# Altium project LimePSB-RPCM_1v3.PrjPcb (part 10 of 14)

## Sheet 13_RFFE.SchDoc: RF front end
size A3; Organization: Lime Microsystems; Address1: Surrey Tech Centre; Address2: Guildford GU2 7YG; Address3: Surrey; Address4: United Kingdom; Revision: v1.3; SheetNumber: 11; SheetTotal: 13
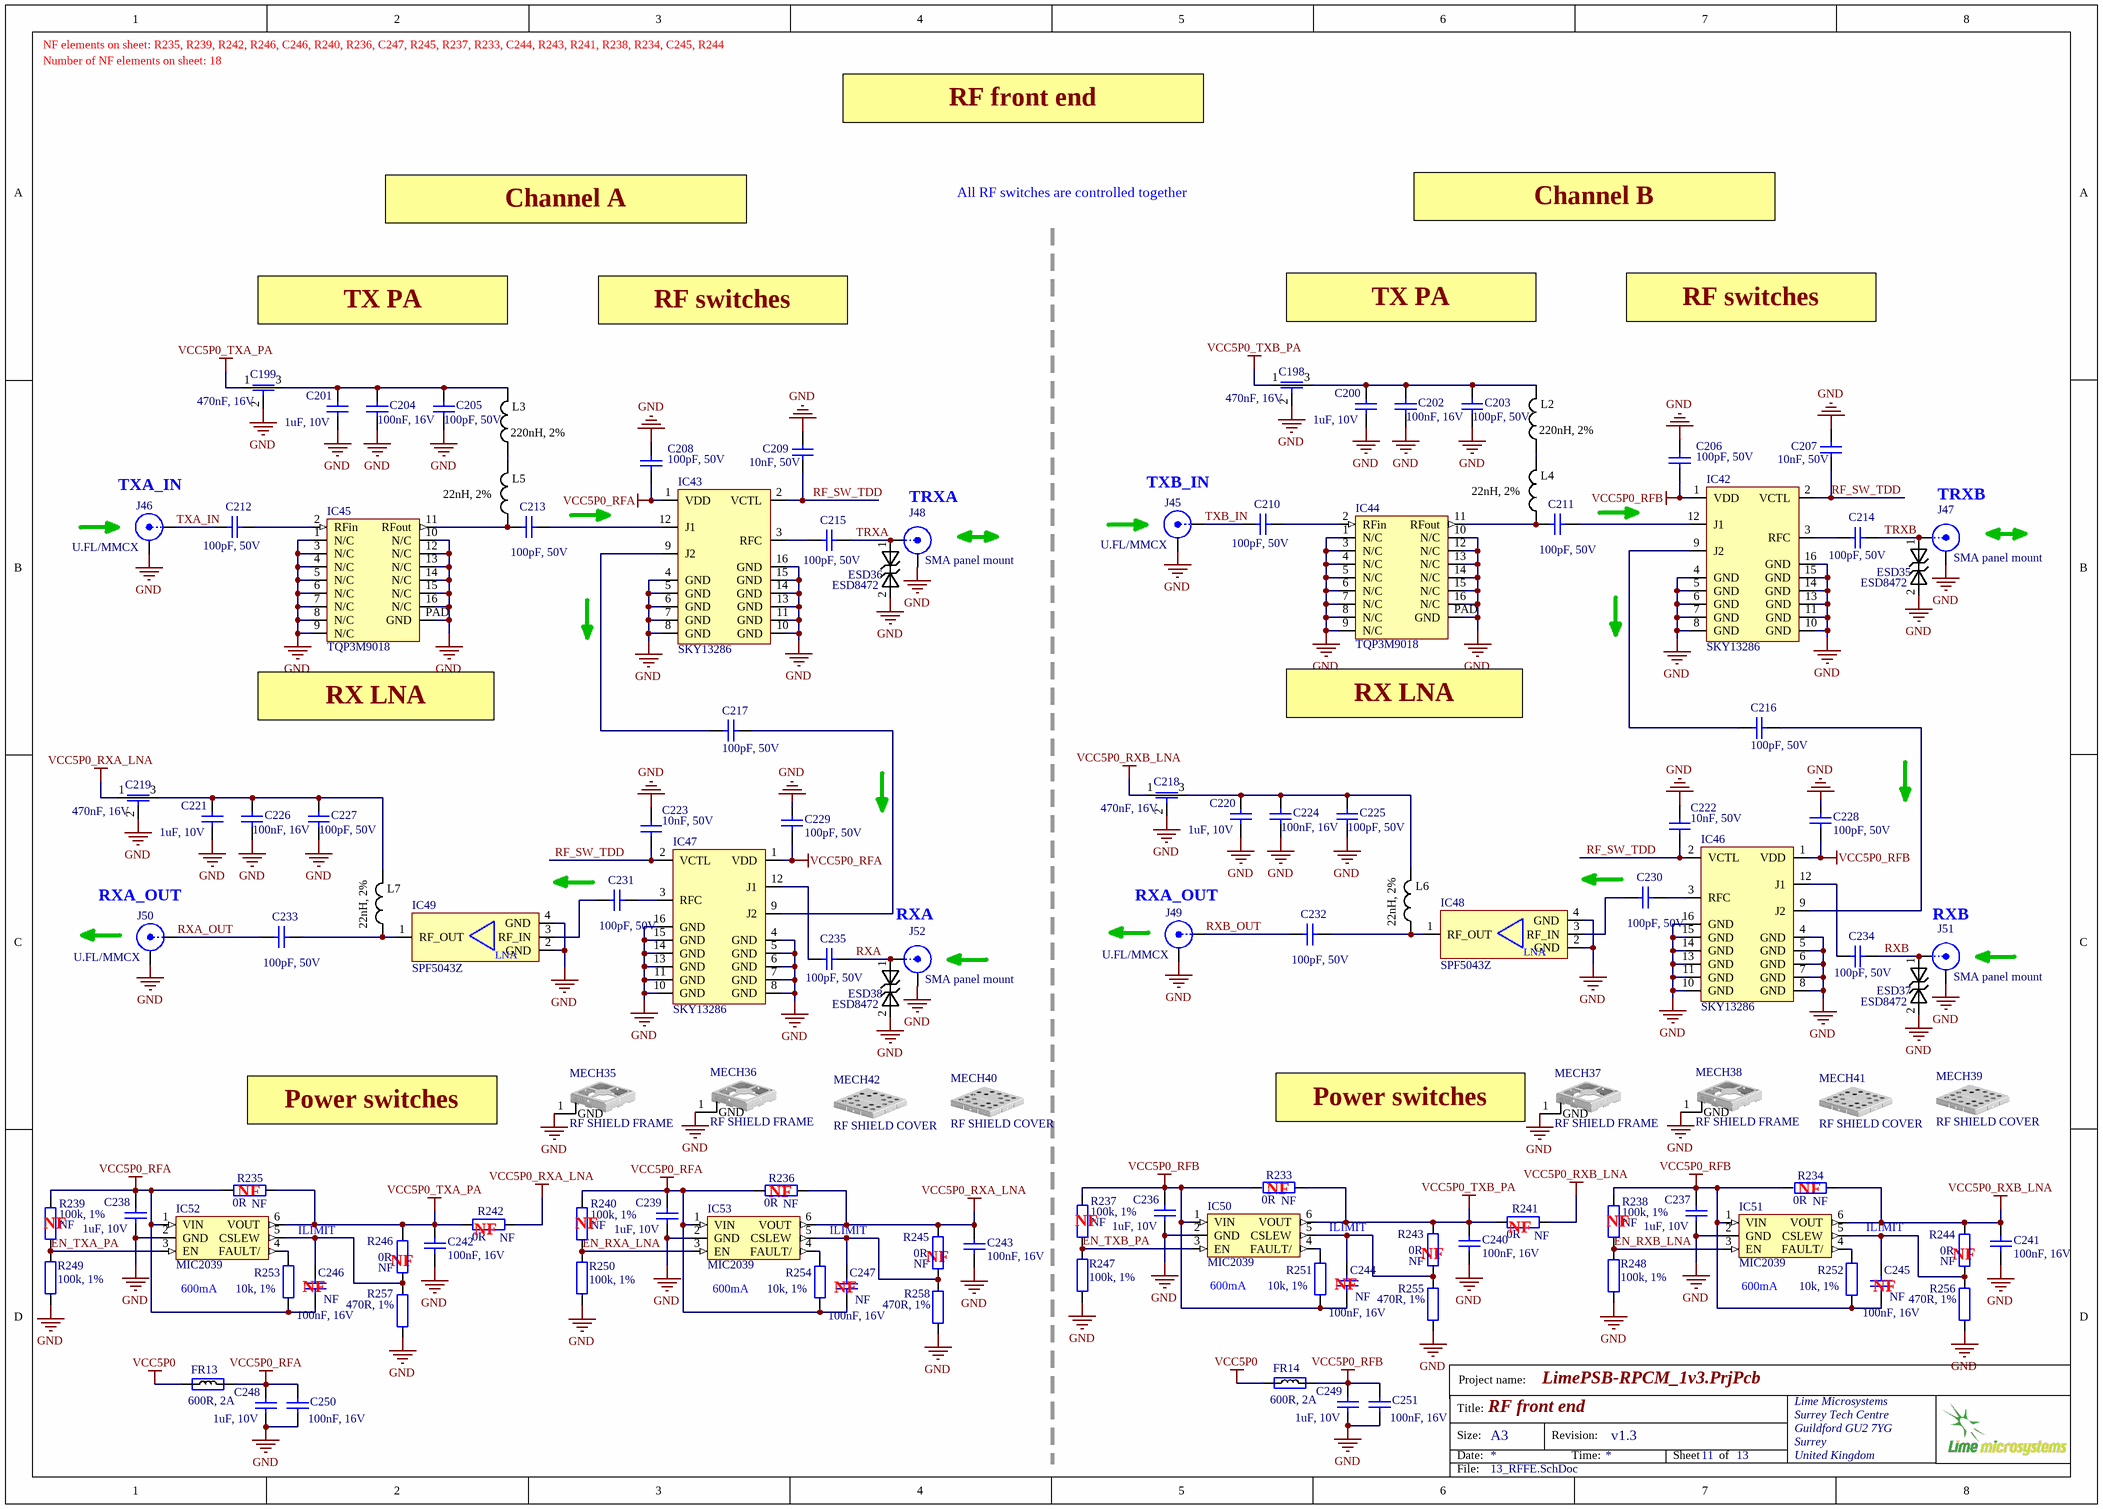
[diagram p12: 13_RFFE.SchDoc]

### Parts
C198  470nF, 16V  [CAP0805_FEEDTHROUGH]
C199  470nF, 16V  [CAP0805_FEEDTHROUGH]
C200  1uF, 10V  [CAP0402]
C201  1uF, 10V  [CAP0402]
C202  100nF, 16V  [CAP0402]
C203  100pF, 50V  [CAP0402]
C204  100nF, 16V  [CAP0402]
C205  100pF, 50V  [CAP0402]
C206  100pF, 50V  [CAP0402]
C207  10nF, 50V  [CAP0402]
C208  100pF, 50V  [CAP0402]
C209  10nF, 50V  [CAP0402]
C210  100pF, 50V  [CAP0402]
C211  100pF, 50V  [CAP0402]
C212  100pF, 50V  [CAP0402]
C213  100pF, 50V  [CAP0402]
C214  100pF, 50V  [CAP0402]
C215  100pF, 50V  [CAP0402]
C216  100pF, 50V  [CAP0402]
C217  100pF, 50V  [CAP0402]
C218  470nF, 16V  [CAP0805_FEEDTHROUGH]
C219  470nF, 16V  [CAP0805_FEEDTHROUGH]
C220  1uF, 10V  [CAP0402]
C221  1uF, 10V  [CAP0402]
C222  10nF, 50V  [CAP0402]
C223  10nF, 50V  [CAP0402]
C224  100nF, 16V  [CAP0402]
C225  100pF, 50V  [CAP0402]
C226  100nF, 16V  [CAP0402]
C227  100pF, 50V  [CAP0402]
C228  100pF, 50V  [CAP0402]
C229  100pF, 50V  [CAP0402]
C230  100pF, 50V  [CAP0402]
C231  100pF, 50V  [CAP0402]
C232  100pF, 50V  [CAP0402]
C233  100pF, 50V  [CAP0402]
C234  100pF, 50V  [CAP0402]
C235  100pF, 50V  [CAP0402]
C236  1uF, 10V  [CAP0402]
C237  1uF, 10V  [CAP0402]
C238  1uF, 10V  [CAP0402]
C239  1uF, 10V  [CAP0402]
C240  100nF, 16V  [CAP0402]
C241  100nF, 16V  [CAP0402]
C242  100nF, 16V  [CAP0402]
C243  100nF, 16V  [CAP0402]
C244  100nF, 16V  Assembly Info: NF  [CAP0402]
C245  100nF, 16V  Assembly Info: NF  [CAP0402]
C246  100nF, 16V  Assembly Info: NF  [CAP0402]
C247  100nF, 16V  Assembly Info: NF  [CAP0402]
C248  1uF, 10V  [CAP0402]
C249  1uF, 10V  [CAP0402]
C250  100nF, 16V  [CAP0402]
C251  100nF, 16V  [CAP0402]
ESD35  ESD8472  [ESD8472_X3DFN2]
ESD36  ESD8472  [ESD8472_X3DFN2]
ESD37  ESD8472  [ESD8472_X3DFN2]
ESD38  ESD8472  [ESD8472_X3DFN2]
FR13  600R, 2A  [RES0805]
FR14  600R, 2A  [RES0805]
IC42  SKY13286  [SKY13286-359LF_RF_switch_QFN16]
IC43  SKY13286  [SKY13286-359LF_RF_switch_QFN16]
IC44  TQP3M9018  [TQP3M9018_PA_QFN16]
IC45  TQP3M9018  [TQP3M9018_PA_QFN16]
IC46  SKY13286  [SKY13286-359LF_RF_switch_QFN16]
IC47  SKY13286  [SKY13286-359LF_RF_switch_QFN16]
IC48  SPF5043Z  [SPF5043Z_SOT-343]
IC49  SPF5043Z  [SPF5043Z_SOT-343]
IC50  MIC2039  [SOT23-6]
IC51  MIC2039  [SOT23-6]
IC52  MIC2039  [SOT23-6]
IC53  MIC2039  [SOT23-6]
J45  U.FL/MMCX  [MMCX_UFL_conn_u]
J46  U.FL/MMCX  [MMCX_UFL_conn_u]
J47  SMA panel mount  [SMA_connector_side]
J48  SMA panel mount  [SMA_connector_side]
J49  U.FL/MMCX  [MMCX_UFL_conn_u]
J50  U.FL/MMCX  [MMCX_UFL_conn_u]
J51  SMA panel mount  [SMA_connector_side]
J52  SMA panel mount  [SMA_connector_side]
L2  220nH, 2%  [RES0603]
L3  220nH, 2%  [RES0603]
L4  22nH, 2%  [RES0603]
L5  22nH, 2%  [RES0603]
L6  22nH, 2%  [RES0603]
L7  22nH, 2%  [RES0603]
MECH35  RF SHIELD FRAME  [RF_SHIELD_FRAME_16P5x16P5_2118716-2_v1]
MECH36  RF SHIELD FRAME  [RF_SHIELD_FRAME_16P5x16P5_2118716-2_v1]
MECH37  RF SHIELD FRAME  [RF_SHIELD_FRAME_16P5x16P5_2118716-2_v1]
MECH38  RF SHIELD FRAME  [RF_SHIELD_FRAME_16P5x16P5_2118716-2_v1]
MECH39  RF SHIELD COVER  [RF_SHIELD_COVER_16Px916P9_2118715-2]
MECH40  RF SHIELD COVER  [RF_SHIELD_COVER_16Px916P9_2118715-2]
MECH41  RF SHIELD COVER  [RF_SHIELD_COVER_16Px916P9_2118715-2]
MECH42  RF SHIELD COVER  [RF_SHIELD_COVER_16Px916P9_2118715-2]
R233  0R  Assembly Info: NF  [RES0402]
R234  0R  Assembly Info: NF  [RES0402]
R235  0R  Assembly Info: NF  [RES0402]
R236  0R  Assembly Info: NF  [RES0402]
R237  100k, 1%  Assembly Info: NF  [RES0402]
R238  100k, 1%  Assembly Info: NF  [RES0402]
R239  100k, 1%  Assembly Info: NF  [RES0402]
R240  100k, 1%  Assembly Info: NF  [RES0402]
R241  0R  Assembly Info: NF  [RES0805]
R242  0R  Assembly Info: NF  [RES0805]
R243  0R  Assembly Info: NF  [RES0402]
R244  0R  Assembly Info: NF  [RES0402]
R245  0R  Assembly Info: NF  [RES0402]
R246  0R  Assembly Info: NF  [RES0402]
R247  100k, 1%  [RES0402]
R248  100k, 1%  [RES0402]
R249  100k, 1%  [RES0402]
R250  100k, 1%  [RES0402]
R251  10k, 1%  [RES0402]
R252  10k, 1%  [RES0402]
R253  10k, 1%  [RES0402]
R254  10k, 1%  [RES0402]
R255  470R, 1%  [RES0402]
R256  470R, 1%  [RES0402]
R257  470R, 1%  [RES0402]
R258  470R, 1%  [RES0402]

### Nets
GND: C198.2 C199.2 C200.1 C201.1 C202.2 C203.1 C204.2 C205.1 C206.2 C207.1 C208.2 C209.1 C218.2 C219.2 C220.1 C221.1 C222.2 C223.2 C224.2 C225.1 C226.2 C227.1 C228.2 C229.2 C236.2 C237.2 C238.2 C239.2 C240.2 C241.2 C242.2 C243.2 C248.1 C249.1 C250.2 C251.2 ESD35.2 ESD36.2 ESD37.2 ESD38.2 IC42.4(GND) IC42.5(GND) IC42.6(GND) IC42.7(GND) IC42.8(GND) IC42.10(GND) IC42.11(GND) IC42.13(GND) IC42.14(GND) IC42.15(GND) IC42.16(GND) IC43.4(GND) IC43.5(GND) IC43.6(GND) IC43.7(GND) IC43.8(GND) IC43.10(GND) IC43.11(GND) IC43.13(GND) IC43.14(GND) IC43.15(GND) IC43.16(GND) IC44.1(N/C) IC44.3(N/C) IC44.4(N/C) IC44.5(N/C) IC44.6(N/C) IC44.7(N/C) IC44.8(N/C) IC44.9(N/C) IC44.10(N/C) IC44.12(N/C) IC44.13(N/C) IC44.14(N/C) IC44.15(N/C) IC44.16(N/C) IC44.PAD(GND) IC45.1(N/C) IC45.3(N/C) IC45.4(N/C) IC45.5(N/C) IC45.6(N/C) IC45.7(N/C) IC45.8(N/C) IC45.9(N/C) IC45.10(N/C) IC45.12(N/C) IC45.13(N/C) IC45.14(N/C) IC45.15(N/C) IC45.16(N/C) IC45.PAD(GND) IC46.4(GND) IC46.5(GND) IC46.6(GND) IC46.7(GND) IC46.8(GND) IC46.10(GND) IC46.11(GND) IC46.13(GND) IC46.14(GND) IC46.15(GND) IC46.16(GND) IC47.4(GND) IC47.5(GND) IC47.6(GND) IC47.7(GND) IC47.8(GND) IC47.10(GND) IC47.11(GND) IC47.13(GND) IC47.14(GND) IC47.15(GND) IC47.16(GND) IC48.2(GND) IC48.4(GND) IC49.2(GND) IC49.4(GND) IC50.2(GND) IC51.2(GND) IC52.2(GND) IC53.2(GND) J45.2(Y) J46.2(Y) J47.2(Y) J48.2(Y) J49.2(Y) J50.2(Y) J51.2(Y) J52.2(Y) MECH35.1(GND) MECH36.1(GND) MECH37.1(GND) MECH38.1(GND) R247.2 R248.2 R249.2 R250.2 R255.1 R256.1 R257.1 R258.1
VCC5P0: FR13.1 FR14.1
VCC5P0_RFA: C208.1 C229.1 C238.1 C239.1 C246.2 C247.2 C248.2 C250.1 FR13.2 IC43.1(VDD) IC47.1(VDD) IC52.1(VIN) IC53.1(VIN) R235.2 R236.2 R239.1 R240.1 R253.1 R254.1
VCC5P0_RFB: C206.1 C228.1 C236.1 C237.1 C244.2 C245.2 C249.2 C251.1 FR14.2 IC42.1(VDD) IC46.1(VDD) IC50.1(VIN) IC51.1(VIN) R233.2 R234.2 R237.1 R238.1 R251.1 R252.1
VCC5P0_RXA_LNA: C219.1 C243.1 IC53.6(VOUT) R236.1 R242.1 R245.2
VCC5P0_RXB_LNA: C218.1 C241.1 IC51.6(VOUT) R234.1 R241.1 R244.2
VCC5P0_TXA_PA: C199.1 C242.1 IC52.6(VOUT) R235.1 R242.2 R246.2
VCC5P0_TXB_PA: C198.1 C240.1 IC50.6(VOUT) R233.1 R241.2 R243.2
EN_RXA_LNA: IC53.3(EN) R240.2 R250.1
EN_RXB_LNA: IC51.3(EN) R238.2 R248.1
EN_TXA_PA: IC52.3(EN) R239.2 R249.1
EN_TXB_PA: IC50.3(EN) R237.2 R247.1
RF_SW_TDD: C207.2 C209.2 C222.1 C223.1 IC42.2(VCTL) IC43.2(VCTL) IC46.2(VCTL) IC47.2(VCTL)
RXA: C235.1 ESD38.1 J52.1(X)
RXA_OUT: C233.2 J50.1(X)
RXB: C234.1 ESD37.1 J51.1(X)
RXB_OUT: C232.2 J49.1(X)
TRXA: C215.1 ESD36.1 J48.1(X)
TRXB: C214.1 ESD35.1 J47.1(X)
TXA_IN: C212.2 J46.1(X)
TXB_IN: C210.2 J45.1(X)
NetC198_3: C198.3 C200.2 C202.1 C203.2 L2.1
NetC199_3: C199.3 C201.2 C204.1 C205.2 L3.1
NetC210_1: C210.1 IC44.2(RFin)
NetC211_1: C211.1 IC42.12(J1)
NetC211_2: C211.2 IC44.11(RFout) L4.2
NetC212_1: C212.1 IC45.2(RFin)
NetC213_1: C213.1 IC43.12(J1)
NetC213_2: C213.2 IC45.11(RFout) L5.2
NetC214_2: C214.2 IC42.3(RFC)
NetC215_2: C215.2 IC43.3(RFC)
NetC216_1: C216.1 IC46.9(J2)
NetC216_2: C216.2 IC42.9(J2)
NetC217_1: C217.1 IC47.9(J2)
NetC217_2: C217.2 IC43.9(J2)
NetC218_3: C218.3 C220.2 C224.1 C225.2 L6.1
NetC219_3: C219.3 C221.2 C226.1 C227.2 L7.1
NetC230_1: C230.1 IC46.3(RFC)
NetC230_2: C230.2 IC48.3(RF_IN)
NetC231_1: C231.1 IC47.3(RFC)
NetC231_2: C231.2 IC49.3(RF_IN)
NetC232_1: C232.1 IC48.1(RF_OUT) L6.2
NetC233_1: C233.1 IC49.1(RF_OUT) L7.2
NetC234_2: C234.2 IC46.12(J1)
NetC235_2: C235.2 IC47.12(J1)
NetC244_1: C244.1 IC50.5(CSLEW) R243.1 R255.2
NetC245_1: C245.1 IC51.5(CSLEW) R244.1 R256.2
NetC246_1: C246.1 IC52.5(CSLEW) R246.1 R257.2
NetC247_1: C247.1 IC53.5(CSLEW) R245.1 R258.2
NetIC50_4: IC50.4(FAULT/) R251.2
NetIC51_4: IC51.4(FAULT/) R252.2
NetIC52_4: IC52.4(FAULT/) R253.2
NetIC53_4: IC53.4(FAULT/) R254.2
NetL2_2: L2.2 L4.1
NetL3_2: L3.2 L5.1

### Notes on the sheet
- NF elements on sheet: R235, R239, R242, R246, C246, R240, R236, C247, R245, R237, R233, C244, R243, R241, R238, R234, C245, R244
- Number of NF elements on sheet: 18
- RF front end
- Channel A
- All RF switches are controlled together
- Channel B
- TX PA
- RF switches
- (near J46) TXA_IN
- TRXA
- (near J45) TXB_IN
- TRXB
- (near IC45) RX LNA
- (near IC44) RX LNA
- (near J50) RXA_OUT
- RXA
- (near J49) RXA_OUT
- RXB
- Power switches
- (near MECH37) Power switches
- (near R233) NF
- (near R234) NF
- (near R239) NF
- (near R235) NF
- ILIMIT
- (near R242) NF
- (near R240) NF
- (near R236) NF
- (near R245) NF
- (near R237) NF
- (near R243) NF
- (near R241) NF
- (near R238) NF
- (near R244) NF
- (near IC52) 600mA
- NF
- (near R246) NF
- (near IC53) 600mA
- (near IC50) 600mA
- (near IC51) 600mA
- (near C245) NF
- Project name:
- Title:
- Size:
- Date:
- A3
- Revision:
- Time:
- Sheet
- of
- File:
- (in symbol SPF5043Z_RF_LNA) LNA

### Library data of the parts
C198 C199 C218 C219 = Cap_feed_through: Part Description: 0.47µF Feed Through Capacitor 16V 2A 30mOhm 0805 (2012 Metric), 3 PC Pad; Manufacturer: Murata; Manufacturer Part Number 1: NFM21PC474R1C3D; Max Current Rating: 2A; Tolerance: 20%; DC Resistance (DCR): 30mR; Insulation Resistance: 1GR; Value: 470nF, 16V; Supplier 1: Digi-Key; Supplier Part Number 1: 490-2537-1-ND; Stock 1: 220606; Pricing 1: 1=0,25000, 10=0,22900, 25=0,21840, 50=0,21160, 100=0,20450, 250=0,19392, 500=0,16218, 1000=0,12586 (USD); Mount: Surface Mount,PCB; Case/Package: 0805; Weight: 0.000194oz; Case Code (Metric): 2012; Case Code (Imperial): 0805; Min Operating Temperature: -55°C; Max Operating Temperature: 125°C; Package Quantity: 1; Capacitance: 470nF; Packaging: Tape and Reel; Max Voltage Rating (DC): 16V; Current Rating: 2A; Voltage Rating: 16V; Voltage Rating (DC): 16V; Voltage: 16V; Current: 2A; Termination: Flat; Length: 2mm; Height: 0.85mm; Width: 1.25mm; Depth: 1.25mm; Radiation Hardening: No; REACH SVHC: No SVHC; Lead Free: Lead Free; RoHS: Yes
C200 C201 C220 C221 C248 C249 = Cap_0402: CAP CER 1UF 10V X5R 0402; Manufacturer: Yageo; Part Description: 1µF 10V Ceramic Capacitor X5R 0402 (1005 Metric) 0.039" L x 0.020" W (1.00mm x 0.50mm); Manufacturer Part Number 1: CC0402MRX5R6BB105; Notification: Current market demand for these product types have resulted in fluctuating and extending lead times. Lead times may differ.; Tolerance: ±20%; Value: 1uF, 10V; Supplier 1: Digi-Key; Supplier Part Number 1: 311-1732-1-ND; RoHS: RoHS Compliant; Applications: General Purpose; Category: Capacitors; ComponentLink1Description: http://www.yageo.com/documents/recent/UPY-GPHC_X5R_4V-to-50V_25.pdf; ComponentLink1URL: http://www.yageo.com/documents/recent/UPY-GPHC_X5R_4V-to-50V_25.pdf; Failure Rate: -; Features: -; Height - Seated (Max): -; Lead Spacing: -; Lead Style: -; Mounting Type: Surface Mount, MLCC; Operating Temperature: -55°C ~ 85°C; Package / Case: 0402 (1005 Metric); Packaging: Cut Tape (CT); Part Status: Active; Pricing 1: 1=0.22, 10=0.156, 100=0.0732, 500=0.0513, 1000=0.04248, 2500=0.03953, 5000=0.03617 (USD); Ratings: -; Size / Dimension: 0.039" L x 0.020" W (1.00mm x 0.50mm); Stock 1: 69600; Temperature Coefficient: X5R; Thickness (Max): 0.022" (0.55mm); Voltage - Rated: 10V
C202 C204 C224 C226 C240-C247 = Cap_0402: Manufacturer: Murata Electronics; Manufacturer Part Number 1: GRM155R71C104KA88D; Part Description: 0.10µF ±10% 16V Ceramic Capacitor X7R 0402 (1005 Metric); Tolerance: 10 %; Type: General Purpose MLCC; Capacitance: 0.1 uF; Case Length: 1 mm; Dielectric: X7R; Case Height: 0.5 mm; Temperature Coefficient / Code: +/- 15 %; Value: 100nF, 16V; Supplier 1: Mouser; Supplier Part Number 1: 81-GRM155R71C104KA88; Case Code - in: 0402; RoHS: RoHS Compliant; Operating Temperature Range: - 55 C to + 125 C; Series: GRM; Termination Style: SMD/SMT; Package / Case: 0402 (1005 metric); Voltage Rating DC: 16 V; Maximum Operating Temperature: + 125 C; Case Code - mm: 1005; Minimum Operating Temperature: - 55 C; Product Category: Low & Medium Capacitance SMD Ceramic Chip Capacitors; Packaging: Reel; Product: General Type MLCCs; Category: Multilayer Ceramic Capacitors MLCC - SMD/SMT; Brand: Murata Electronics; Case Width: 0.5 mm; RoHS - Mouser: Y; Standard Pack Qty: 10000; Minimum Order Quantity: 1; Reeling: True; Manufacturer Part Number: GRM155R71C104KA88D
C203 C205 C206 C208 C210-C217 C225 C227-C235 = Cap_0402: Manufacturer Part Number 1: CC0402JRNPO9BN101; Manufacturer: Yageo; Part Description: 100pF ±5% 50V C0G, NP0 Ceramic Capacitor -55°C ~ 125°C Surface Mount, MLCC 0402 (1005 Metric) 0.039" L x 0.020" W (1.00mm x 0.50mm); Tolerance: ±5%; Temperature Coefficient: C0G, NP0; Value: 100pF, 50V; Capacitance: 100pF; Thickness (Max): 0.022" (0.55mm); Size / Dimension: 0.039" L x 0.020" W (1.00mm x 0.50mm); RoHS: RoHS Compliant; Ratings: -; Package / Case: 0402 (1005 Metric); Mounting Type: Surface Mount, MLCC; Height - Seated (Max): -; Features: -; Lead Spacing: -; Voltage - Rated: 50V; Operating Temperature: -55°C ~ 125°C; Packaging: Cut Tape (CT); Applications: General Purpose; Lead Style: -; Supplier 1: Digi-Key; Category: Capacitors; Supplier Part Number 1: 311-1024-1-ND
C207 C209 C222 C223 = Cap_0402: Part Description: 10000pF ±10% 50V Ceramic Capacitor X7R 0402 (1005 Metric); Manufacturer: Murata Electronics North America; Manufacturer Part Number 1: GRM155R71H103KA88D; Tolerance: ±10%; Temperature Coefficient: X7R; Value: 10nF, 50V; Supplier 1: Digi-Key; Supplier Part Number 1: 490-4516-2-ND; RoHS: RoHS Compliant; Category: Capacitors; Stock 1: 10970000; Pricing 1: 10000=0.00185, 20000=0.00176, 30000=0.00167 (USD); Packaging: Tape & Reel (TR); Part Status: Active; Voltage - Rated: 50V; Operating Temperature: -55°C ~ 125°C; Features: -; Ratings: -; Applications: General Purpose; Mounting Type: Surface Mount, MLCC; Package / Case: 0402 (1005 Metric); Size / Dimension: 0.039" L x 0.020" W (1.00mm x 0.50mm); Height - Seated (Max): -; Thickness (Max): 0.022" (0.55mm); Lead Spacing: -; Lead Style: -; ComponentLink1URL: http://www.murata.com/~/media/webrenewal/support/library/catalog/products/capacitor/mlcc/c02e.ashx?la=en-us; ComponentLink1Description: http://www.murata.com/~/media/webrenewal/support/library/catalog/products/capacitor/mlcc/c02e.ashx?la=en-us
C236-C239 = Cap_0402: Manufacturer Part Number 1: CC0402MRX5R6BB105; Manufacturer: Yageo; Part Description: 1µF 10V Ceramic Capacitor X5R 0402 (1005 Metric) 0.039" L x 0.020" W (1.00mm x 0.50mm); Voltage Rating: 10; Capacitance Tolerance: ± 10%; Product Range: TDK - C Series; Ceramic Capacitor Case: 0402 [1005 Metric]; Capacitance: 1; Dielectric Characteristic: X6; Value: 1uF, 10V; Supplier 1: Digi-Key; Supplier Part Number 1: 311-1732-1-ND; MSL: -; RoHS: YES
C250 C251 = Cap_0603: Manufacturer Part Number 1: GRM155R71C104KA88D; Part Description: 0.10µF ±10% 16V Ceramic Capacitor X7R 0402 (1005 Metric); Brand: Murata Electronics; Tolerance: 10 %; Type: General Purpose MLCC; Capacitance: 0.1 uF; Temperature Coefficient / Code: +/- 15 %; Case Height: 0.5 mm; Case Length: 1 mm; Dielectric: X7R; Supplier 1: Mouser; Supplier Part Number 1: 81-GRM155R71C104KA88; Case Code - in: 0402; Manufacturer: Murata Electronics; Category: Multilayer Ceramic Capacitors MLCC - SMD/SMT; Voltage Rating DC: 16 V; Value: 100nF, 16V; Manufacturer Part Number: GRM155R71C104KA88D; Case Code - mm: 1005; Case Width: 0.5 mm; Maximum Operating Temperature: + 125 C; Minimum Operating Temperature: - 55 C; Minimum Order Quantity: 1; Operating Temperature Range: - 55 C to + 125 C; Package / Case: 0402 (1005 metric); Packaging: Reel; Product: General Type MLCCs; Product Category: Low & Medium Capacitance SMD Ceramic Chip Capacitors; Reeling: True; RoHS - Mouser: Y; RoHS: RoHS Compliant; Series: GRM; Standard Pack Qty: 10000; Termination Style: SMD/SMT
ESD35-ESD38 = ESD8472: Manufacturer: ON Semiconductor; Manufacturer Part Number 1: ESD8472MUT5G; Part Description: TVS DIODE 5.3VWM 14VC X3DFN2; Voltage - Reverse Standoff (Typ): 5.3V (Max); Voltage - Breakdown (Min): 7V; Voltage - Clamping (Max) @ Ipp: 14V; Current - Peak Pulse (10/1000µs): 3A (8/20µs); Power Line Protection: No; Capacitance @ Frequency: 0.2pF @ 1MHz; Supplier 1: Digi-Key; RoHS: RoHS Compliant; Category: Circuit Protection; Stock 1: 2295; Pricing 1: 1=0.39, 10=0.315, 100=0.2142, 500=0.16068, 1000=0.12051 (USD); Packaging: Cut Tape (CT); Part Status: Active; Type: Zener; Power - Peak Pulse: -; Applications: Automotive, RF Antenna; Operating Temperature: -55°C ~ 150°C (TJ); Mounting Type: Surface Mount; Package / Case: 2-XFDFN; Supplier Device Package: 2-X3DFN (0.62x0.32); ComponentLink1URL: http://www.onsemi.com/pub/Collateral/ESD8472-D.PDF; ComponentLink1Description: http://www.onsemi.com/pub/Collateral/ESD8472-D.PDF; Supplier Part Number 1: ESD8472MUT5GOSCT-ND
FR13 FR14 = Ferrite: Manufacturer Part Number 1: MPZ2012S601AT000; Manufacturer: TDK Corporation; Part Description: FERRITE BEAD 600 OHM 0805 1LN; Filter Type: Differential Mode - Single; Impedance @ Frequency: 600 Ohm @ 100MHz; DC Resistance (DCR): 100 mOhm Max; Supplier 1: Digi-Key; Supplier Part Number 1: 445-2206-2-ND; Mounting Type: Surface Mount; RoHS: RoHS Compliant; Height (Max): 0.041" (1.05mm); Packaging: Tape & Reel (TR); Category: Filters; Current Rating: 2A; Package / Case: 0805 (2012 Metric); Size / Dimension: 0.079" L x 0.049" W (2.00mm x 1.25mm); Value: 600R, 2A
IC42 IC43 IC46 IC47 = SKY13286-359LF_RF_switch: Part Description: RF Switch IC GSM, ISM, PCS, WCDMA SPDT 6 GHz 50Ohm 16-QFN (4x4); Manufacturer: Skyworks Solutions; Frequency: 6GHz; Impedance: 50R; Insertion Loss: 1.8dB; Turn-Off Delay Time: 50ns; Throw Configuration: SPDT; IIP3: 46dBm; Operating Frequency: 100 MHz to 6 GHz; Number of Switches: 3; Min Supply Voltage: 2.7V; Max Supply Voltage: 5.5V; P1dB: 30dBm; Min Frequency: 100MHz; Supplier 1: Digi-Key; Supplier Part Number 1: 863-1049-1-ND; Manufacturer Part Number 1: SKY13286-359LF; Stock 1: 60609; Pricing 1: 1=3,45000, 10=3,09600, 25=2,92720, 100=2,53700, 250=2,40684, 500=2,15966, 1000=1,95150 (USD); RoHS: Yes; Mount: Surface Mount; Case/Package: QFN; Number of Pins: 16; Contact Plating: Tin,Matte; Min Operating Temperature: -40°C; Max Operating Temperature: 95°C; Package Quantity: 1; Packaging: Tape and Reel; Turn-On Delay Time: 50ns; Max Frequency: 6GHz; Series: -; Termination: SMD/SMT; Radiation Hardening: No; RoHS Compliant: Yes; REACH SVHC: Unknown; ComponentLink1URL: https://datasheet.ciiva.com/15100/getdatasheetpartid-656005-15100455.pdf?src-supplier=Verical; ComponentLink1Description: https://datasheet.ciiva.com/15100/getdatasheetpartid-656005-15100455.pdf?src-supplier=Verical; ComponentLink2URL: https://datasheet.ciiva.com/12080/200570h-20342-12080171.pdf?src-supplier=Mouser; ComponentLink2Description: https://datasheet.ciiva.com/12080/200570h-20342-12080171.pdf?src-supplier=Mouser
IC44 IC45 = TQP3M9018_PA: Part Description: RF Amplifier .05-4GHz P1dB= 22dB Gain 26.4dB 5Volts; Manufacturer: Qorvo; Manufacturer Part Number 1: TQP3M9019; Supplier 1: Mouser; Supplier Part Number 1: 772-TQP3M9019; Stock 1: 6804; Pricing 1: 1=7,48, 10=7,48, 50=5,43, 100=4,41, 1000=2,44, 10000=2,35 (USD); RoHS: Yes
IC48 IC49 = SPF5043Z_RF_LNA: Part Description: RF Amplifier .05-4GHz SSG 12.9dB NF .8dB GaAs; Manufacturer: Qorvo; Supplier 1: Mouser; Supplier Part Number 1: 772-SPF5043Z; Manufacturer Part Number 1: SPF5043Z; Stock 1: 151851; Pricing 1: 1=3,68000, 10=3,68000, 50=2,67000, 100=2,17000, 1000=1,20000, 10000=1,06000 (USD); RoHS: Yes; RoHS Compliant: Yes
IC50-IC53 = MIC2033_power_switch: Part Description: Power Switch/Driver 1:1 P-Channel 2.5A SOT-23-6; Manufacturer: Microchip; Manufacturer Part Number 1: MIC2039EYM6-TR; Number of Outputs: 1; Interface: On/Off; Max Output Current: 2.5A; Fault Protection: Over Temperature; Output Configuration: High Side; ComponentLink1URL: http://www.mouser.com/ds/2/268/mic2033-b-1076865.pdf?src-supplier=Mouser; ComponentLink1Description: http://www.mouser.com/ds/2/268/mic2033-b-1076865.pdf?src-supplier=Mouser; ComponentLink2URL: http://components.arrow.com/part/dataview/56727820S413982N1374?src-supplier=Arrow+Electronics; ComponentLink2Description: http://components.arrow.com/part/dataview/56727820S413982N1374?src-supplier=Arrow+Electronics; ComponentLink3URL: http://www.microchip.com/mymicrochip/filehandler.aspx?ddocname=en579457&src-supplier=Digi-Key; ComponentLink3Description: http://www.microchip.com/mymicrochip/filehandler.aspx?ddocname=en579457&src-supplier=Digi-Key; Supplier 1: Digi-Key; Supplier Part Number 1: 576-4193-1-ND; Stock 1: 37195; Pricing 1: 1=0,98000, 25=0,80560, 100=0,75000 (USD); RoHS: No; Case/Package: SOT-23-6; Min Operating Temperature: -40°C; Max Operating Temperature: 125°C; Package Quantity: 3000; Packaging: Tape and Reel; Series: -; ComponentLink4URL: https://datasheet.ciiva.com/6607/mic2039-6607725.pdf?src-supplier=Digi-Key; ComponentLink4Description: https://datasheet.ciiva.com/6607/mic2039-6607725.pdf?src-supplier=Digi-Key
J45 J46 J49 J50 = RF_IF_connector: CONN UMC RCPT STR 50 OHM SMD; Manufacturer: Molex, LLC; Manufacturer Part Number 1: 0734120110; Body Finish: Nickel; Body Material: Phosphor Bronze; Center Contact Material: Brass; Center Contact Plating: Gold; Connector Style: Ultra Miniature Coaxial; Connector Type: Jack, Male Pin; Contact Termination: Solder; Dielectric Material: Liquid Crystal Polymer (LCP); Frequency - Max: 6GHz; Impedance: 50 Ohm; Voltage Rating: 60V; Cable Group: -; Category: Connectors, Interconnects; Fastening Type: Snap-On; Features: -; Housing Color: Silver; Ingress Protection: -; Mounting Type: Surface Mount; Operating Temperature: -40°C ~ 90°C; Packaging: Cut Tape (CT); RoHS: RoHS Compliant; Shield Termination: Solder; Supplier 1: Digi-Key; Supplier Part Number 1: WM5587CT-ND; Part Description: CONN UMC RCPT STR 50 OHM SMD
J47 J48 J51 J52 = RF_IF_connector: CONN SMA JACK STR 50OHM EDGE MNT; Manufacturer: Linx; Manufacturer Part Number 1: CONSMA002-L-G; Part Description: SMA Connector Receptacle, Female Socket 50Ohm Panel Mount, Through Hole, Right Angle Solder; Supplier 1: Digi-Key; Supplier Part Number 1: CONSMA002-L-G-ND; Stock 1: 815; Pricing 1: 1=4.08, 25=3.67, 100=3.32, 250=3.25, 500=3, 1000=2.80001, 2000=2.5875 (USD)
L2 L3 = Inductor: Part Description: Fixed Inductors 220 NH 2%; Manufacturer: TDK; Manufacturer Part Number 1: MLZ1608DR22DT000; Value: 220nH, 2%; ComponentLink1URL: http://productfinder.pulseeng.com/products/datasheets/WC701.pdf; ComponentLink1Description: http://productfinder.pulseeng.com/products/datasheets/WC701.pdf; ComponentLink2URL: https://datasheet.ciiva.com/11799/0900766b80a002db-11799279.pdf?src-supplier=RSComponents; ComponentLink2Description: https://datasheet.ciiva.com/11799/0900766b80a002db-11799279.pdf?src-supplier=RSComponents; ComponentLink3URL: https://datasheet.ciiva.com/14124/qhlqw18a-data-e-14124619.pdf?src-supplier=Distrelec; ComponentLink3Description: https://datasheet.ciiva.com/14124/qhlqw18a-data-e-14124619.pdf?src-supplier=Distrelec; ComponentLink4URL: https://datasheet.ciiva.com/6705/l0075s0080lqw18a-00-6705627.pdf?src-supplier=Digi-Key; ComponentLink4Description: https://datasheet.ciiva.com/6705/l0075s0080lqw18a-00-6705627.pdf?src-supplier=Digi-Key; ComponentLink5URL: https://datasheet.ciiva.com/6705/l0075s0080lqw18a-00-6705626.pdf?src-supplier=Digi-Key; ComponentLink5Description: https://datasheet.ciiva.com/6705/l0075s0080lqw18a-00-6705626.pdf?src-supplier=Digi-Key; ComponentLink6URL: https://datasheet.ciiva.com/6705/l0075s0080lqw18a-00-6705631.pdf?src-supplier=Digi-Key; ComponentLink6Description: https://datasheet.ciiva.com/6705/l0075s0080lqw18a-00-6705631.pdf?src-supplier=Digi-Key; ComponentLink7URL: https://datasheet.ciiva.com/4977/product-4977173.pdf?src-supplier=Mouser; ComponentLink7Description: https://datasheet.ciiva.com/4977/product-4977173.pdf?src-supplier=Mouser; ComponentLink8URL: https://datasheet.ciiva.com/46391/1487239-46391853.pdf?src-supplier=Element14; ComponentLink8Description: https://datasheet.ciiva.com/46391/1487239-46391853.pdf?src-supplier=Element14; ComponentLink9URL: https://datasheet.ciiva.com/8507/l0075s0080lqw18a-00-8507496.pdf?src-supplier=Avnet; ComponentLink9Description: https://datasheet.ciiva.com/8507/l0075s0080lqw18a-00-8507496.pdf?src-supplier=Avnet; Supplier 1: Digikey; Supplier Part Number 1: 445-6387-1-ND; Stock 1: 11427; Pricing 1: 1=0,12, 10=0,095, 25=0,0876, 50=0,0772, 100=0,0676, 250=0,06436, 500=0,06052, 1000=0,04635 (USD); RoHS: Yes; ComponentLink10URL: https://datasheet.ciiva.com/29698/inductor-commercial-decoupling-mlz-en-29698909.pdf?src-supplier=Digikey; ComponentLink10Description: https://datasheet.ciiva.com/29698/inductor-commercial-decoupling-mlz-en-29698909.pdf?src-supplier=Digikey; ComponentLink11URL: https://datasheet.ciiva.com/29698/inductor-commercial-decoupling-mlz-en-29698910.pdf?src-supplier=Digikey; ComponentLink11Description: https://datasheet.ciiva.com/29698/inductor-commercial-decoupling-mlz-en-29698910.pdf?src-supplier=Digikey; ComponentLink12URL: https://datasheet.ciiva.com/29698/inductor-commercial-decoupling-mlz-en-29698911.pdf?src-supplier=Digikey; ComponentLink12Description: https://datasheet.ciiva.com/29698/inductor-commercial-decoupling-mlz-en-29698911.pdf?src-supplier=Digikey
L4-L7 = Inductor: Manufacturer: Murata; Manufacturer Part Number 1: LQW18AN22NG00D; Part Description: Fixed Inductors 22 NH 2%; Core Material: Non-Magnetic; Self Resonant Frequency: 4.6GHz; Shielding: Unshielded; Q Factor: 40; Current Rating: 500mA; DC Resistance (DCR): 170mR; Test Frequency: 100MHz; Current: 400mA; Value: 22nH, 2%; ComponentLink1URL: http://productfinder.pulseeng.com/products/datasheets/WC701.pdf; ComponentLink1Description: http://productfinder.pulseeng.com/products/datasheets/WC701.pdf; Parameter 1: *; Supplier 1: Digi-Key; Supplier Part Number 1: 490-6874-1-ND; Stock 1: 60315; Pricing 1: 1=0,18000, 10=0,16300, 25=0,14520, 50=0,12340, 100=0,10890, 250=0,09984, 500=0,09076, 1000=0,07623 (USD); RoHS: Yes; Mount: Surface Mount; Case/Package: 0603; Number of Pins: 2; Weight: 0.000106oz; Case Code (Metric): 1608; Case Code (Imperial): 0603; Min Operating Temperature: -55°C; Max Operating Temperature: 125°C; Tolerance: 2%; Inductance Tolerance: 2%; Packaging: Tape and Reel; Package Quantity: 4000; Inductance: 22nH; Max DC Current: 500mA; Termination: SMD/SMT; Resistor Type: Wirewound; DC Current: 500mA; Series Resistance: 170mR; Series: LQW18A_00; Rated Current-Max: 500mA; Length: 1.6mm; Width: 0.8mm; Height: 0.8mm; Height - Seated (Max): 0.039inch; Depth: 1mm; REACH SVHC: No SVHC; Military Standard: Not; Lead Free: Lead Free; RoHS Compliant: Yes; ComponentLink2URL: https://datasheet.ciiva.com/11799/0900766b80a002db-11799279.pdf?src-supplier=RSComponents; ComponentLink2Description: https://datasheet.ciiva.com/11799/0900766b80a002db-11799279.pdf?src-supplier=RSComponents; ComponentLink3URL: https://datasheet.ciiva.com/14124/qhlqw18a-data-e-14124619.pdf?src-supplier=Distrelec; ComponentLink3Description: https://datasheet.ciiva.com/14124/qhlqw18a-data-e-14124619.pdf?src-supplier=Distrelec; ComponentLink4URL: https://datasheet.ciiva.com/6705/l0075s0080lqw18a-00-6705627.pdf?src-supplier=Digi-Key; ComponentLink4Description: https://datasheet.ciiva.com/6705/l0075s0080lqw18a-00-6705627.pdf?src-supplier=Digi-Key; ComponentLink5URL: https://datasheet.ciiva.com/6705/l0075s0080lqw18a-00-6705626.pdf?src-supplier=Digi-Key; ComponentLink5Description: https://datasheet.ciiva.com/6705/l0075s0080lqw18a-00-6705626.pdf?src-supplier=Digi-Key; ComponentLink6URL: https://datasheet.ciiva.com/6705/l0075s0080lqw18a-00-6705631.pdf?src-supplier=Digi-Key; ComponentLink6Description: https://datasheet.ciiva.com/6705/l0075s0080lqw18a-00-6705631.pdf?src-supplier=Digi-Key; ComponentLink7URL: https://datasheet.ciiva.com/4977/product-4977173.pdf?src-supplier=Mouser; ComponentLink7Description: https://datasheet.ciiva.com/4977/product-4977173.pdf?src-supplier=Mouser; ComponentLink8URL: https://datasheet.ciiva.com/46391/1487239-46391853.pdf?src-supplier=Element14; ComponentLink8Description: https://datasheet.ciiva.com/46391/1487239-46391853.pdf?src-supplier=Element14; ComponentLink9URL: https://datasheet.ciiva.com/8507/l0075s0080lqw18a-00-8507496.pdf?src-supplier=Avnet; ComponentLink9Description: https://datasheet.ciiva.com/8507/l0075s0080lqw18a-00-8507496.pdf?src-supplier=Avnet
MECH35-MECH38 = RF_SHIELD_FRAME_16P5x16P5_2118716-2: Part Description: RF Shield Frame 0.650" (16.50mm) X 0.650" (16.50mm) Surface Mount; Manufacturer: TE Connectivity; Supplier 1: Digi-Key; Supplier Part Number 1: A126152CT-ND; Manufacturer Part Number 1: 2118716-2; Stock 1: 26553; Pricing 1: 1=0,93000, 10=0,81600, 25=0,76680, 100=0,62570, 250=0,58120 (USD); RoHS: Yes; ComponentLink1URL: https://www.te.com/commerce/DocumentDelivery/DDEController?Action=srchrtrv&DocNm=2118716&DocType=Customer+Drawing&DocLang=English&src-supplier=Digi-Key; ComponentLink1Description: https://www.te.com/commerce/DocumentDelivery/DDEController?Action=srchrtrv&DocNm=2118716&DocType=Customer+Drawing&DocLang=English&src-supplier=Digi-Key
MECH39-MECH42 = RF_SHIELD_COVER_16P9x16P9_2118715-2: Part Description: RF Shield Cover 0.665" (16.90mm) X 0.665" (16.90mm) Vented Surface Mount; Manufacturer: TE Connectivity; ComponentLink1URL: https://www.te.com/commerce/DocumentDelivery/DDEController?Action=srchrtrv&DocNm=2118716&DocType=Customer+Drawing&DocLang=English&src-supplier=Digi-Key; ComponentLink1Description: https://www.te.com/commerce/DocumentDelivery/DDEController?Action=srchrtrv&DocNm=2118716&DocType=Customer+Drawing&DocLang=English&src-supplier=Digi-Key; Supplier 1: Digi-Key; Supplier Part Number 1: A126120-ND; Manufacturer Part Number 1: 2118715-2; Stock 1: 58094; Pricing 1: 1=1,44000, 10=1,28900, 25=1,22400, 100=1,00530, 250=0,93972, 500=0,83046, 1000=0,65562, 2500=0,61191, 5000=0,58132 (USD); RoHS: Yes; ComponentLink2URL: https://www.te.com/commerce/DocumentDelivery/DDEController?Action=srchrtrv&DocNm=2118715&DocType=Customer+Drawing&DocLang=English&src-supplier=Digi-Key; ComponentLink2Description: https://www.te.com/commerce/DocumentDelivery/DDEController?Action=srchrtrv&DocNm=2118715&DocType=Customer+Drawing&DocLang=English&src-supplier=Digi-Key
R233-R236 R243-R246 = Res_0402: Manufacturer Part Number 1: RC0402JR-070RL; Manufacturer: Yageo; Part Description: RES SMD 0.0OHM JUMPER 1/16W 0402; Resistance (Ohms): 0.0; Tolerance: Jumper; Power (Watts): 0.063W, 1/16W; Value: 0R; Supplier 1: Digi-Key; Supplier Part Number 1: 311-0.0JRTR-ND; Category: Resistors; Temperature Coefficient: -; Features: Moisture Resistant; Supplier Device Package: 0402; Height: 0.016" (0.40mm); Package / Case: 0402 (1005 Metric); Operating Temperature: -55°C ~ 155°C; Size / Dimension: 0.039" L x 0.020" W (1.00mm x 0.50mm); Composition: Thick Film; Packaging: Tape & Reel (TR); Number of Terminations: 2; RoHS: RoHS Compliant
R237-R240 R247-R250 = Res_0402: Part Description: 100 kOhms ±1% 0.063W, 1/16W Chip Resistor 0402 (1005 Metric) Thick Film; Manufacturer: Vishay; Manufacturer Part Number 1: CRCW0402100KFKEDC; Power Rating: 62.5mW; Resistance: 100kR; Temperature Coefficient: 100ppm/°C; Value: 100k, 1%; Supplier 1: Digi-Key; Supplier Part Number 1: 541-3960-6-ND; Stock 1: 702107; Pricing 1: 1=0,10000, 10=0,03300, 100=0,01360, 1000=0,00610, 2500=0,00529, 5000=0,00437 (USD); RoHS: Yes; Mount: Surface Mount; Case/Package: SMD/SMT; Contact Plating: Tin; Min Operating Temperature: -55°C; Max Operating Temperature: 155°C; Tolerance: 1%; Resistor Type: Thick Film; Termination: Wraparound; Length: 1mm; Lead Free: Lead Free; RoHS Compliant: Yes; ComponentLink1URL: http://www.vishay.com/docs/28773/crcwce3.pdf?src-supplier=Digi-Key; ComponentLink1Description: http://www.vishay.com/docs/28773/crcwce3.pdf?src-supplier=Digi-Key
R241 R242 = Res_0402: Manufacturer Part Number 1: CRCW08050000Z0EA; Manufacturer: Vishay Dale; Part Description: RES SMD 0.0 OHM JUMPER 1/8W 0805; Power (Watts): 0.125W, 1/8W; Resistance (Ohms): 0.0; Tolerance: Jumper; Value: 0R; Supplier 1: Digi-Key; Supplier Part Number 1: 541-0.0ATR-ND; Package / Case: 0805 (2012 Metric); Height: 0.020" (0.50mm); Packaging: Tape & Reel (TR); Operating Temperature: -55°C ~ 155°C; Temperature Coefficient: -; RoHS: RoHS Compliant; Size / Dimension: 0.079" L x 0.049" W (2.00mm x 1.25mm); Supplier Device Package: 0805 (2012 Metric); Number of Terminations: 2; Category: Resistors; Features: Automotive AEC-Q200; Composition: Thick Film
R251-R254 = Res_0402: Manufacturer: Yageo; Manufacturer Part Number 1: RC0402FR-0710KL; Part Description: RES SMD 10K OHM 1% 1/16W 0402; Temperature Coefficient: ±100ppm/°C; Power (Watts): 0.063W, 1/16W; Value: 10k, 1%; Supplier 1: Digi-Key; Supplier Part Number 1: 311-10.0KLRTR-ND; Resistance (Ohms): 10k; Packaging: Tape & Reel (TR); RoHS: RoHS Compliant; Package / Case: 0402 (1005 Metric); Tolerance: ±1%; Operating Temperature: -55°C ~ 155°C; Size / Dimension: 0.039" L x 0.020" W (1.00mm x 0.50mm); Number of Terminations: 2; Category: Resistors; Height: 0.016" (0.40mm); Supplier Device Package: 0402; Features: Moisture Resistant; Composition: Thick Film
R255-R258 = Res_0402: Manufacturer 1: Yageo; Manufacturer Part Number 1: RC0402FR-07470RL; Part Description: 470 Ohms ±1% 0.063W, 1/16W Chip Resistor 0402 (1005 Metric) Moisture Resistant Thick Film; Power Rating: 62.5mW; Temperature Coefficient: 100ppm/°C; Voltage Rating: 50V; Max Power Dissipation: 63mW; Value: 470R, 1%; Supplier 1: Digi-Key; Supplier Part Number 1: 311-470LRCT-ND; Stock 1: 1652476; Pricing 1: 1=0,10000, 10=0,01600, 100=0,00660, 1000=0,00299, 2500=0,00259, 5000=0,00214 (USD); RoHS: Yes; Case/Package: 0402; Case Code (Metric): 1005; Case Code (Imperial): 0402; Size Code: 0402; Min Operating Temperature: -55°C; Max Operating Temperature: 155°C; Packaging: Tape and Reel; Tolerance: 1%; Resistance: 470R; Number of Terminations: 2; Features: Moisture Resistant; Package Quantity: 1; Resistor Type: Thick Film; Termination: SMD/SMT; Series: RC; Resistance Tolerance: 1%; Construction: Rectangular; Length: 1mm; Width: 0.02inch; Height: 0.016inch; Depth: 0.5mm; Lead Free: Lead Free; REACH SVHC: Unknown; Military Standard: Not; RoHS Compliant: Yes; Manufacturer: Yageo

## Sheet 14_PoE_USB_PD.SchDoc: PoE and USB PD
size A3; Organization: Lime Microsystems; Address1: Surrey Tech Centre; Address2: Guildford GU2 7YG; Address3: Surrey; Address4: United Kingdom; Revision: v1.3; SheetNumber: 12; SheetTotal: 13
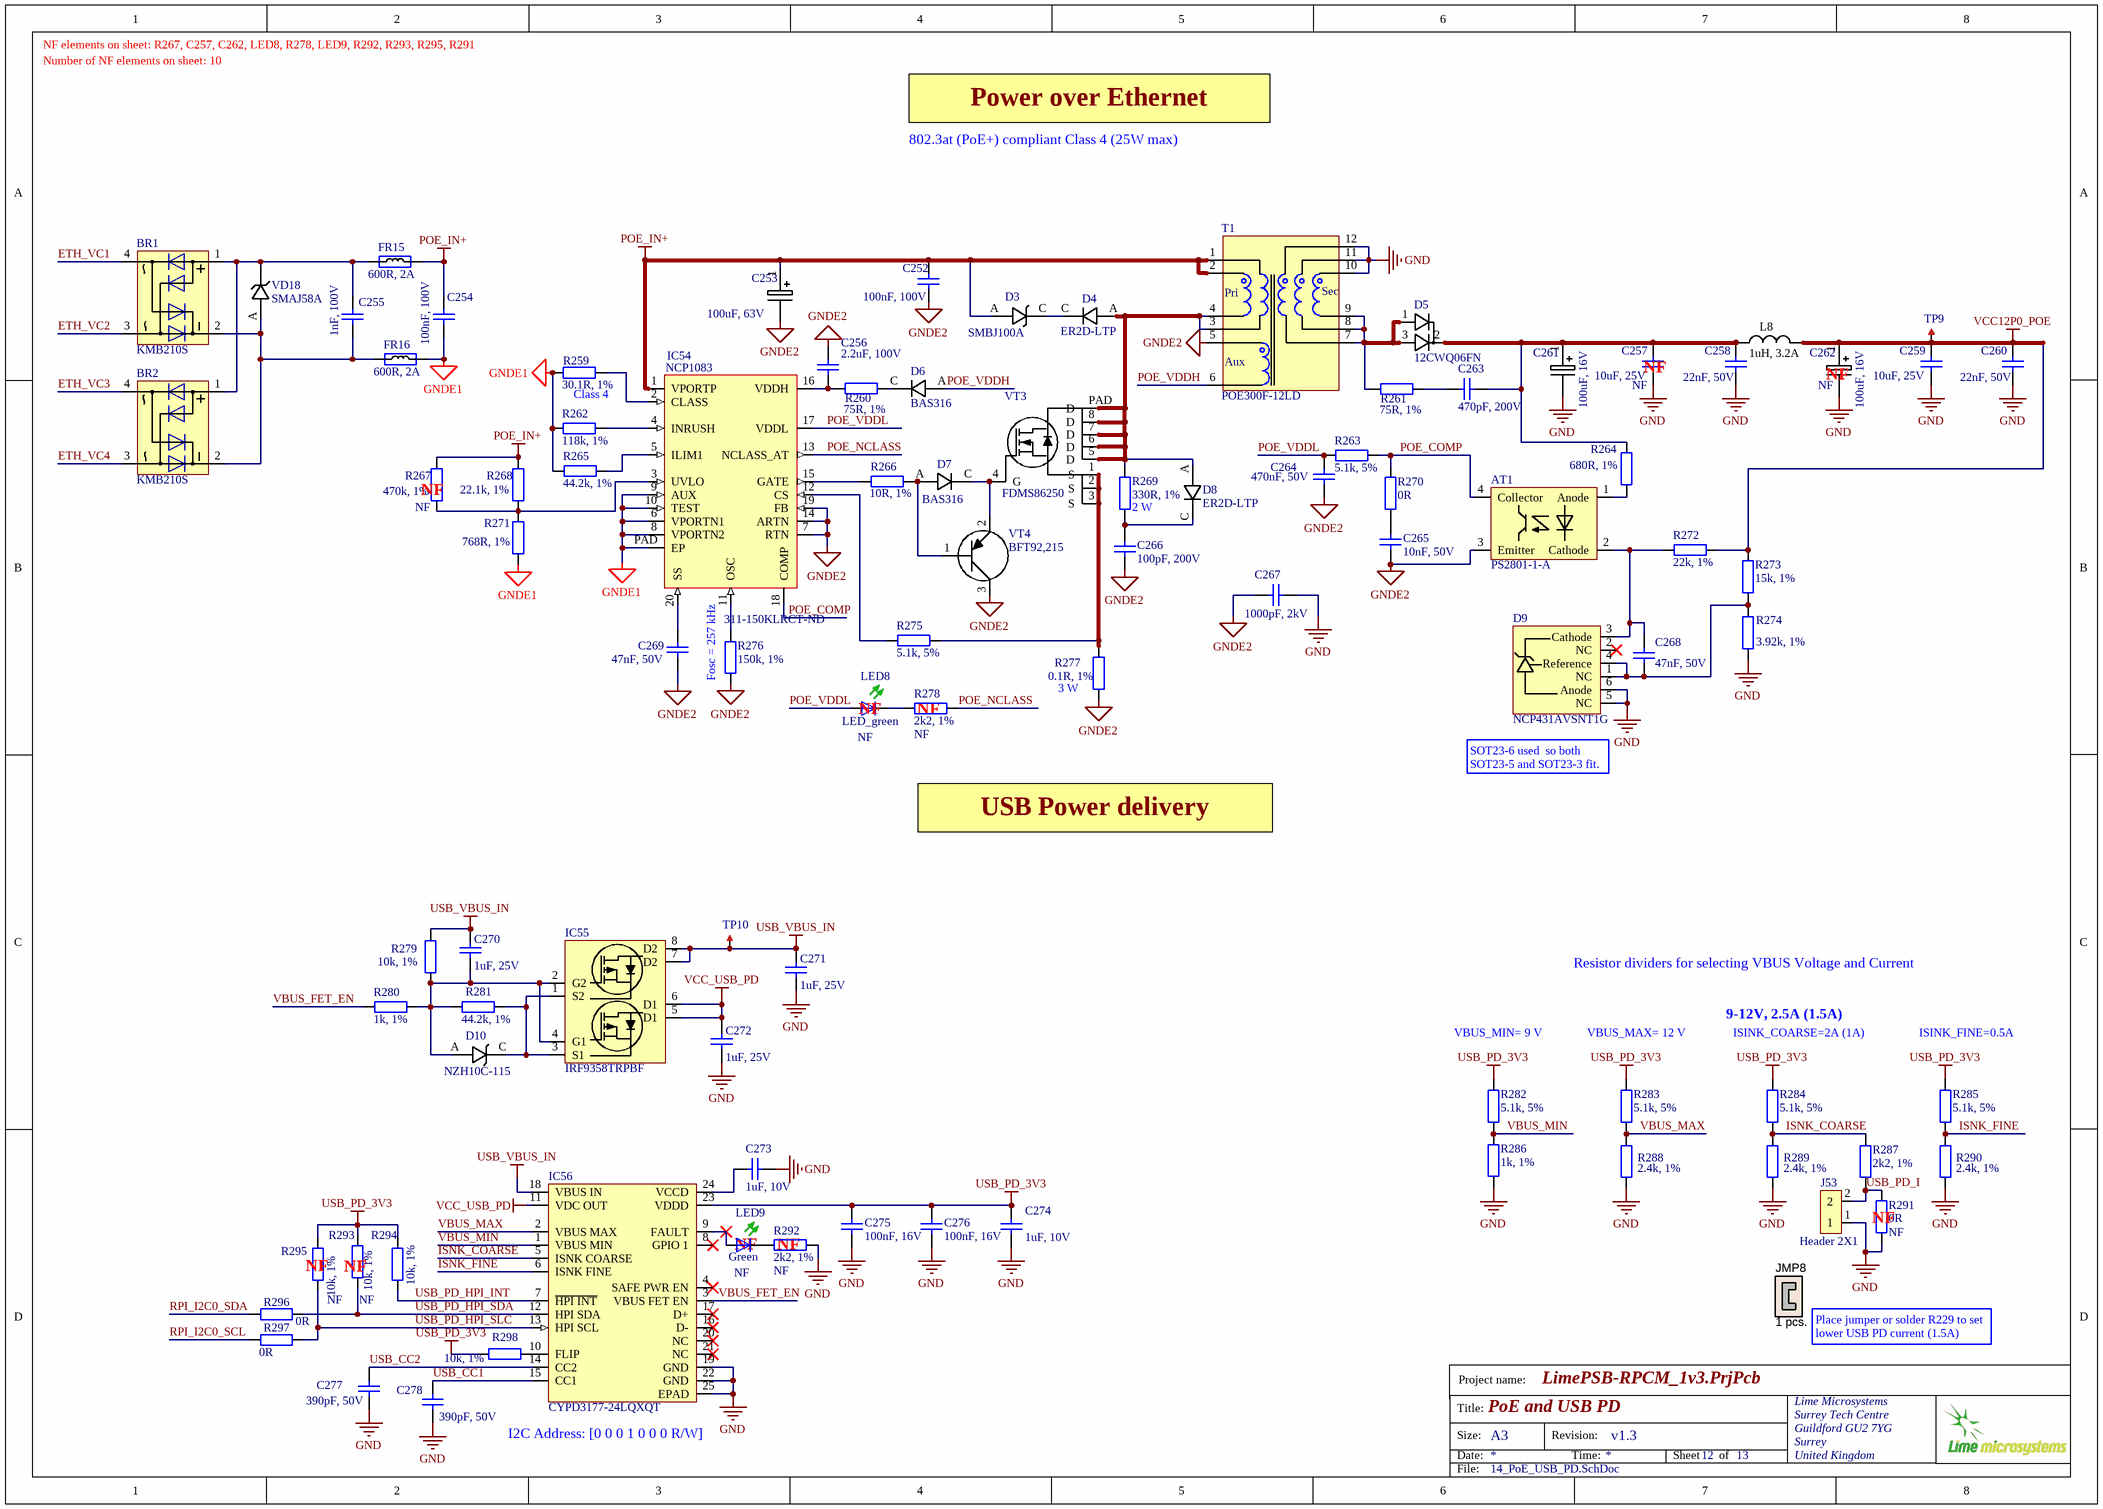
[diagram p13: 14_PoE_USB_PD.SchDoc]

### Parts
AT1  PS2801-1-A  [TCMT1107CT_optoisolator]
BR1  KMB210S  [KMB210S_RECTIFIER_BRIDGE]
BR2  KMB210S  [KMB210S_RECTIFIER_BRIDGE]
C252  100nF, 100V  [CAP0603]
C253  100uF, 63V  [CAP_POL_D10_H10]
C254  100nF, 100V  [CAP0603]
C255  1nF, 100V  [CAP0603]
C256  2.2uF, 100V  [CAP1206]
C257  10uF, 25V  Assembly Info: NF  [CAP0805]
C258  22nF, 50V  [CAP0402]
C259  10uF, 25V  [CAP0805]
C260  22nF, 50V  [CAP0402]
C261  100uF, 16V  [CAP_POL_SIZE_F_v2]
C262  100uF, 16V  Assembly Info: NF  [CAP_POL_SIZE_F_v2]
C263  470pF, 200V  [CAP0603]
C264  470nF, 50V  [CAP0603]
C265  10nF, 50V  [CAP0402]
C266  100pF, 200V  [CAP0603]
C267  1000pF, 2kV  [CAP1812]
C268  47nF, 50V  [CAP0603]
C269  47nF, 50V  [CAP0603]
C270  1uF, 25V  [CAP0603]
C271  1uF, 25V  [CAP0603]
C272  1uF, 25V  [CAP0603]
C273  1uF, 10V  [CAP0402]
C274  1uF, 10V  [CAP0402]
C275  100nF, 16V  [CAP0402]
C276  100nF, 16V  [CAP0402]
C277  390pF, 50V  [CAP0402]
C278  390pF, 50V  [CAP0402]
D3  SMBJ100A  [SMBJ100A_DIODE_DO-214AA]
D4  ER2D-LTP  [ER2D-LTP_DIODE_DO-214AA]
D5  12CWQ06FN  [12CWQ06FN_diode_array_DPAK]
D6  BAS316  [BAS316_DIODE_SOD323]
D7  BAS316  [BAS316_DIODE_SOD323]
D8  ER2D-LTP  [ER2D-LTP_DIODE_DO-214AA]
D9  NCP431AVSNT1G  [SOT23-6]
D10  NZH10C-115  [NZH10C,115_shottky_diode_SOD123]
FR15  600R, 2A  [RES0805]
FR16  600R, 2A  [RES0805]
IC54  NCP1083  [NCP1083_PoE_controller_TSSOP20]
IC55  IRF9358TRPBF  [IRF9358TRPBF_DUAL_NMOS_SOIC8]
IC56  CYPD3177-24LQXQT  [USB_POWER_DISTR_CYPD3177_QFN24]
J53  Header 2X1  [HDR_1x2]
JMP8  1 pcs.  (mechanical)
L8  1uH, 3.2A  [NRS4018T3R3MDGJ_inductor]
LED8  LED_green  Assembly Info: NF  [LED-0603-GREEN]
LED9  Green  Assembly Info: NF  [LED-0603-GREEN]
R259  30.1R, 1%  [RES0402]
R260  75R, 1%  [RES0402]
R261  75R, 1%  [RES0402]
R262  118k, 1%  [RES0402]
R263  5.1k, 5%  [RES0402]
R264  680R, 1%  [RES0402]
R265  44.2k, 1%  [RES0402]
R266  10R, 1%  [RES0603]
R267  470k, 1%  Assembly Info: NF  [RES0402]
R268  22.1k, 1%  [RES0402]
R269  330R, 1%  [RES2512]
R270  0R  [RES0402]
R271  768R, 1%  [RES0402]
R272  22k, 1%  [RES0402]
R273  15k, 1%  [RES0402]
R274  3.92k, 1%  [RES0402]
R275  5.1k, 5%  [RES0402]
R276  150k, 1%  Supplier Part Number 1: 311-150KLRCT-ND  [RES0402]
R277  0.1R, 1%  [RES2512]
R278  2k2, 1%  Assembly Info: NF  [RES0402]
R279  10k, 1%  [RES0402]
R280  1k, 1%  [RES0402]
R281  44.2k, 1%  [RES0402]
R282  5.1k, 5%  [RES0402]
R283  5.1k, 5%  [RES0402]
R284  5.1k, 5%  [RES0402]
R285  5.1k, 5%  [RES0402]
R286  1k, 1%  [RES0402]
R287  2k2, 1%  [RES0402]
R288  2.4k, 1%  [RES0402]
R289  2.4k, 1%  [RES0402]
R290  2.4k, 1%  [RES0402]
R291  0R  Assembly Info: NF  [RES0402]
R292  2k2, 1%  Assembly Info: NF  [RES0402]
R293  10k, 1%  Assembly Info: NF  [RES0402]
R294  10k, 1%  [RES0402]
R295  10k, 1%  Assembly Info: NF  [RES0402]
R296  0R  [RES0402]
R297  0R  [RES0402]
R298  10k, 1%  [RES0402]
T1  POE300F-12LD  [POE300F50LD_TRANSFORMER]
TP9  TESTPOINT_PAD  [TP_PAD_1p5MM]  (value not drawn)  (no BOM)
TP10  TESTPOINT_PAD  [TP_PAD_1p5MM]  (value not drawn)  (no BOM)
VD18  SMAJ58A  [SMAJ58A_shottky_diode]
VT3  FDMS86250  [FDMS86250_NMOS_POWER56]
VT4  BFT92,215  [BFT92,215_PNP_STO23-3]

### Nets
GND: C257.1 C258.2 C259.1 C260.2 C261.2 C262.2 C267.1 C271.1 C272.1 C273.1 C274.1 C275.2 C276.2 C277.2 C278.2 D9.5(NC) D9.6(Anode) IC56.19(GND) IC56.22(GND) IC56.25(EPAD) J53.1 R274.2 R286.2 R288.1 R289.1 R290.1 R291.2 R292.2 T1.10 T1.11 T1.12
GNDE1: C254.1 FR16.2 IC54.6(VPORTN1) IC54.8(VPORTN2) IC54.9(AUX) IC54.10(TEST) IC54.PAD(EP) R259.1 R262.1 R265.2 R271.2
GNDE2: AT1.3(Emitter) C252.1 C253.2 C256.2 C264.1 C265.1 C266.2 C267.2 C269.1 IC54.7(RTN) IC54.14(ARTN) IC54.19(FB) R276.1 R277.1 T1.5 VT4.3(C)
POE_IN+: C252.2 C253.1 C254.2 D3.A FR15.2 IC54.1(VPORTP) R267.2 R268.2 T1.1 T1.2
USB_PD_3V3: C274.2 C275.1 C276.1 IC56.23(VDDD) R282.1 R283.1 R284.1 R285.1 R293.2 R294.2 R295.2 R298.1
USB_VBUS_IN: C270.2 C271.2 IC55.7(D2) IC55.8(D2) IC56.18(VBUS_IN) R279.2 TP10.1
VCC12P0_POE: C259.2 C260.1 C262.1 L8.2 R272.1 R273.1 TP9.1
VCC_USB_PD: C272.2 IC55.5(D1) IC55.6(D1) IC56.11(VDC_OUT)
ETH_VC1: BR1.4
ETH_VC2: BR1.3
ETH_VC3: BR2.4
ETH_VC4: BR2.3
ISNK_COARSE: IC56.5(ISNK_COARSE) R284.2 R287.2 R289.2
ISNK_FINE: IC56.6(ISNK_FINE) R285.2 R290.2
POE_COMP: AT1.4(Collector) IC54.18(COMP) R263.1 R270.1
POE_NCLASS: IC54.13(NCLASS_AT) R278.2
POE_VDDH: D6.A T1.6
POE_VDDL: C264.2 IC54.17(VDDL) LED8.A R263.2
RPI_I2C0_SCL: R297.2
RPI_I2C0_SDA: R296.2
USB_CC1: C278.1 IC56.15(CC1)
USB_CC2: C277.1 IC56.14(CC2)
USB_PD_HPI_INT: IC56.7(~{HPI_INT}) R294.1
USB_PD_HPI_SDA: IC56.12(HPI_SDA) R293.1 R296.1
USB_PD_HPI_SLC: IC56.13(HPI_SCL) R295.1 R297.1
USB_PD_I: J53.2 R287.1 R291.1
VBUS_FET_EN: IC56.3(VBUS_FET_EN) R280.2
VBUS_MAX: IC56.2(VBUS_MAX) R283.2 R288.2
VBUS_MIN: IC56.1(VBUS_MIN) R282.2 R286.1
NetAT1_1: AT1.1(Anode) R264.2
NetAT1_2: AT1.2(Cathode) C268.2 D9.3(Cathode) R272.2
NetBR1_1: BR1.1 BR2.1 C255.1 FR15.1 VD18.K
NetBR1_2: BR1.2 BR2.2 C255.2 FR16.1 VD18.A
NetC256_1: C256.1 IC54.16(VDDH) R260.1
NetC257_2: C257.2 C258.1 C261.1 C263.2 D5.2 L8.1 R264.1
NetC263_1: C263.1 R261.2
NetC265_2: C265.2 R270.2
NetC266_1: C266.1 D8.C R269.1
NetC268_1: C268.1 D9.1(NC) D9.4(Reference) R273.2 R274.1
NetC269_2: C269.2 IC54.20(SS)
NetC270_1: C270.1 D10.A IC55.2(G2) IC55.4(G1) R279.1 R280.1 R281.2
NetC273_2: C273.2 IC56.24(VCCD)
NetD3_C: D3.C D4.C
NetD4_A: D4.A D8.A R269.2 T1.3 T1.4 VT3.5(D) VT3.6(D) VT3.7(D) VT3.8(D) VT3.PAD(D)
NetD5_1: D5.1 D5.3 R261.1 T1.7 T1.8 T1.9
NetD6_C: D6.C R260.2
NetD7_A: D7.A R266.1 VT4.1(S)
NetD7_C: D7.C VT3.4(G) VT4.2(E)
NetD10_C: D10.C IC55.1(S2) IC55.3(S1) R281.1
NetIC54_2: IC54.2(CLASS) R259.2
NetIC54_3: IC54.3(UVLO) R267.1 R268.1 R271.1
NetIC54_4: IC54.4(INRUSH) R262.2
NetIC54_5: IC54.5(ILIM1) R265.1
NetIC54_11: IC54.11(OSC) R276.2
NetIC54_12: IC54.12(CS) R275.2
NetIC54_15: IC54.15(GATE) R266.2
NetIC56_9: IC56.9(FAULT) LED9.A
NetIC56_10: IC56.10(FLIP) R298.2
NetLED8_K: LED8.K(C) R278.1
NetLED9_K: LED9.K(C) R292.1
NetR275_1: R275.1 R277.2 VT3.1(S) VT3.2(S) VT3.3(S)

Not connected (* = marked no-connect by the designer): D9 2(NC)*; IC56 4(SAFE_PWR_EN)* 8(GPIO_1)* 16(D-)* 17(D+)* 20(NC)* 21(NC)*; JMP8 1 2

### Notes on the sheet
- NF elements on sheet: R267, C257, C262, LED8, R278, LED9, R292, R293, R295, R291
- Number of NF elements on sheet: 10
- 802.3at (PoE+) compliant Class 4 (25W max)
- Power over Ethernet
- (near C257) NF
- (near C262) NF
- Class 4
- (near R267) NF
- (near R269) 2 W
- Fosc = 257 kHz
- (near LED8) NF
- (near R278) NF
- (near R277) 3 W
- (near D9) SOT23-6 used  so both SOT23-5 and SOT23-3 fit.
- USB Power delivery
- Resistor dividers for selecting VBUS Voltage and Current
- (near R282) VBUS_MIN= 9 V
- (near R283) VBUS_MAX= 12 V
- 9-12V, 2.5A (1.5A)
- (near R284) ISINK_COARSE=2A (1A)
- (near R285) ISINK_FINE=0.5A
- NF
- (near R292) NF
- (near R291) NF
- (near R295) NF
- (near R293) NF
- Place jumper or solder R229 to set lower USB PD current (1.5A)
- (near IC56) I2C Address: [0 0 0 1 0 0 0 R/W]
- Project name:
- Title:
- Size:
- Date:
- A3
- Revision:
- Time:
- Sheet
- of
- File:
- (in symbol POE300F-50LD_transformer) Pri; Sec; Aux